# Altium schematic sheet FEEL_2021_sensors.SchDoc
size A4; SheetNumber: 4; SheetTotal: 5
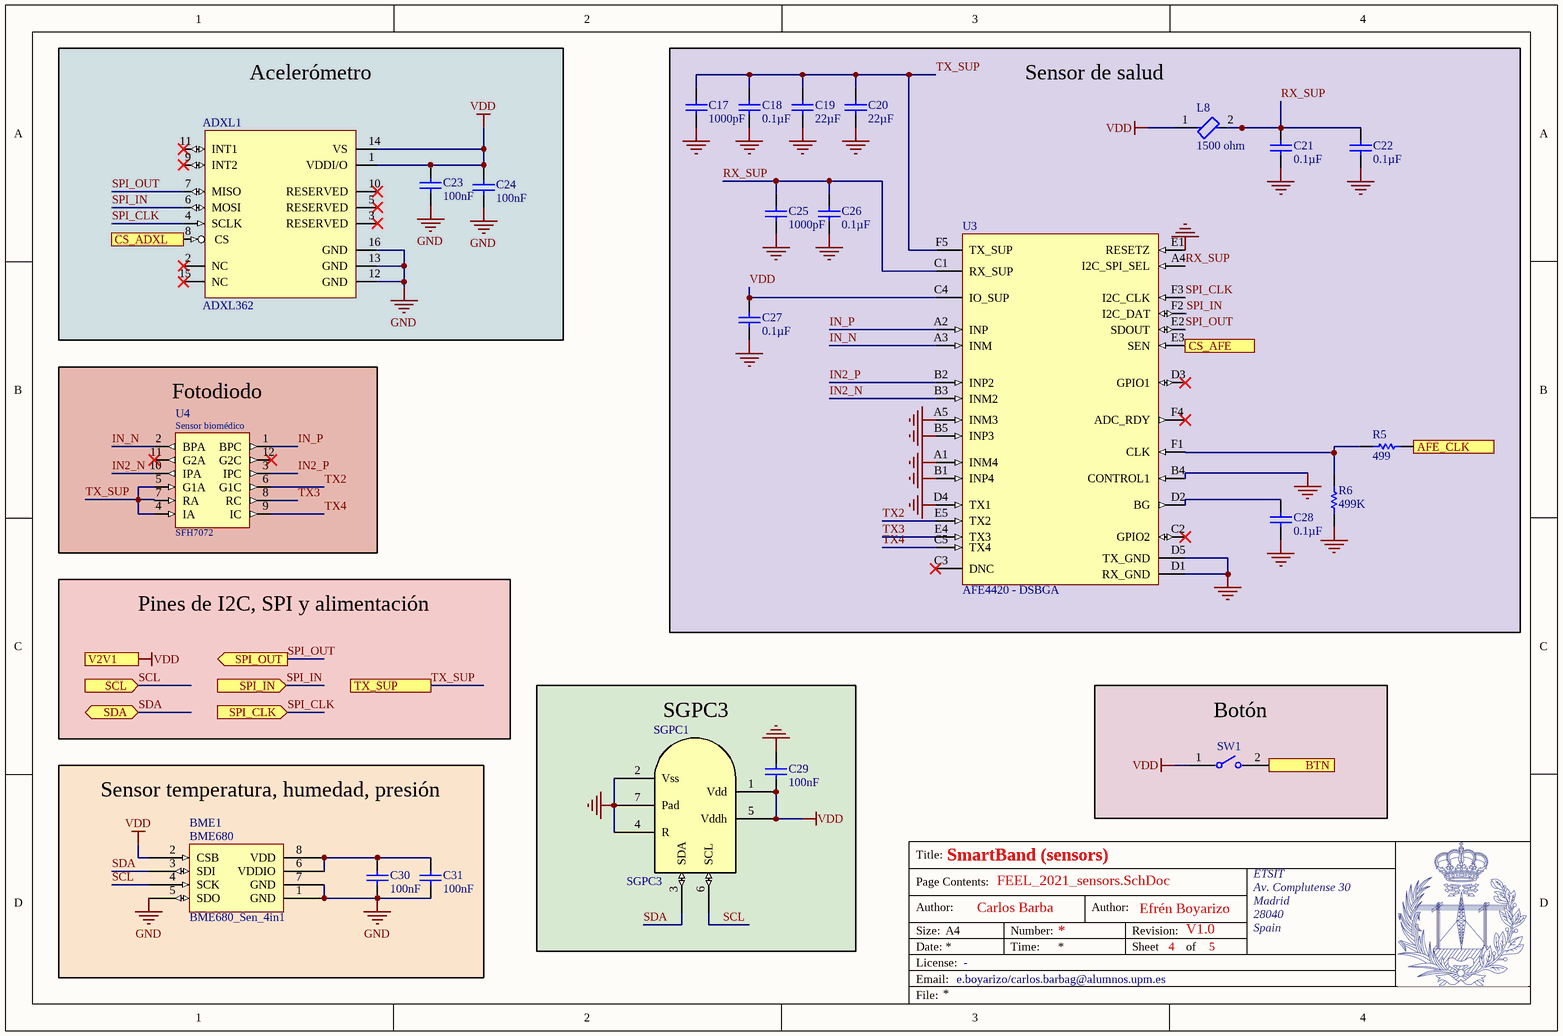
[diagram p0: FEEL_2021_sensors.SchDoc]

## Parts
ADXL1  (no value)  [ADXL362 - duplicate]
BME1  BME680_Sen_4in1  [BME_LGA8]
C17  1000pF  [CAPC1608X90X35ML10T15]
C18  0.1µF  [CAPC1608X90X35ML10T15]
C19  22µF  [CAPC1608X90X35ML10T15]
C20  22µF  [CAPC1608X90X35ML10T15]
C21  0.1µF  [CAPC1608X90X35ML10T15]
C22  0.1µF  [CAPC1608X90X35ML10T15]
C23  100nF  [CAPC1608X90X35ML10T15]
C24  100nF  [CAPC1608X90X35ML10T15]
C25  1000pF  [CAPC1608X90X35ML10T15]
C26  0.1µF  [CAPC1608X90X35ML10T15]
C27  0.1µF  [CAPC1608X90X35ML10T15]
C28  0.1µF  [CAPC1608X90X35ML10T15]
C29  100nF  [CAPC1608X90X35ML10T15]
C30  100nF  [CAPC1608X90X35ML10T15]
C31  100nF  [CAPC1608X90X35ML10T15]
L8  1500 ohm  [FP-BLM18-0_15-t0_8-MFG]
R5  499  [RESC1609X50X30NL8T20]
R6  499K  [RESC1609X50X30NL8T20]
SGPC1  SGPC3  [DFN 6-pin]
SW1  (no value)  [FP-B3U-1000P-MFG]
U3  AFE4420 - DSBGA  [AFE4420 - DSBGA]
U4  (no value)  [SFH7072]

## Ports
AFE_CLK (in), BTN (out), CS_ADXL (in), CS_AFE (in), SCL (in), SDA (bidir), SPI_CLK (in), SPI_IN (in), SPI_OUT (out), TX_SUP, V2V1

## Nets
GND: ADXL1.12(GND) ADXL1.13(GND) ADXL1.16(GND) BME1.1(GND) BME1.5(SDO) BME1.7(GND) C17.1 C18.1 C19.1 C20.1 C21.1 C22.1 C23.1 C24.1 C25.1 C26.1 C27.1 C28.1 C29.2 C30.1 C31.1 R6.1 SGPC1.2(Vss) SGPC1.4(R) SGPC1.7(Pad) U3.A1(INM4) U3.A5(INM3) U3.B1(INP4) U3.B4(CONTROL1) U3.B5(INP3) U3.D1(RX_GND) U3.D4(TX1) U3.D5(TX_GND) U3.E1(RESETZ)
VDD: ADXL1.1(VDDI/O) ADXL1.14(VS) BME1.2(CSB) C23.2 C24.2 C27.2 C29.1 L8.1 SGPC1.1(Vdd) SGPC1.5(Vddh) SW1.1 U3.C4(IO_SUP) ; port V2V1
AFE_CLK: R5.1 ; port AFE_CLK
BTN: SW1.2 ; port BTN
CS_ADXL: ADXL1.8(CS) ; port CS_ADXL
CS_AFE: U3.E3(SEN) ; port CS_AFE
IN2_N: U3.B3(INM2) U4.10(IPA)
IN2_P: U3.B2(INP2) U4.3(IPC)
IN_N: U3.A3(INM) U4.2(BPA)
IN_P: U3.A2(INP) U4.1(BPC)
RX_SUP: C21.2 C22.2 C25.2 C26.2 L8.2 U3.A4(I2C_SPI_SEL) U3.C1(RX_SUP)
SCL: BME1.4(SCK) SGPC1.6(SCL) ; port SCL
SDA: BME1.3(SDI) SGPC1.3(SDA) ; port SDA
SPI_CLK: ADXL1.4(SCLK) U3.F3(I2C_CLK) ; port SPI_CLK
SPI_IN: ADXL1.6(MOSI) U3.F2(I2C_DAT) ; port SPI_IN
SPI_OUT: ADXL1.7(MISO) U3.E2(SDOUT) ; port SPI_OUT
TX2: U3.E5(TX2) U4.6(G1C)
TX3: U3.E4(TX3) U4.8(RC)
TX4: U3.C5(TX4) U4.9(IC)
TX_SUP: C17.2 C18.2 C19.2 C20.2 U3.F5(TX_SUP) U4.4(IA) U4.5(G1A) U4.7(RA) ; port TX_SUP
NetBME1_6: BME1.6(VDDIO) BME1.8(VDD) C30.2 C31.2
NetC28_2: C28.2 U3.D2(BG)
NetR5_2: R5.2 R6.2 U3.F1(CLK)

Not connected (* = marked no-connect by the designer): ADXL1 2(NC)* 3(RESERVED)* 5(RESERVED)* 9(INT2)* 10(RESERVED)* 11(INT1)* 15(NC)*; U3 C2(GPIO2)* C3(DNC)* D3(GPIO1)* F4(ADC_RDY)*; U4 11(G2A)* 12(G2C)*

## Notes on the sheet
- Acelerómetro
- (near U4) Fotodiodo
- Sensor de salud
- Pines de I2C, SPI y alimentación
- Title:
- SmartBand (sensors)
- (near SW1) Botón
- Author:
- Page Contents:
- Carlos Barba
- Efrén Boyarizo
- V1.0
- ETSIT
- Av. Complutense 30
- Madrid
- 28040
- Sensor temperatura, humedad, presión
- SGPC3
- Size:
- Date:
- File:
- License:
- Email:
- A4
- e.boyarizo/carlos.barbag@alumnos.upm.es
- -
- Number:
- Time:
- Revision:
- Sheet
- of
- 5
- Spain
- (in symbol BME680_Sen_4in1) BME680
- (in symbol SFH7072) Sensor biomédico

## Library data of the parts
ADXL1 = ADXL362
C17-C31 = CMP-2000-04945-1: Chip Capacitor, 22 pF, +/- 5%, 50 V, -55 to 125 degC, 0603 (1608 Metric), RoHS, Tape and Reel; Manufacturer: Murata; Capacitance: 22pF; Rated Voltage: 50V; Dielectric: C0G; Manufacturer URL: http://www.murata.com/; Datasheet Version: Jul-06; Package Reference: 603; Tolerance (%): ±5%; Case Size/Dimension: 0603; Package Description: 2-Pin Surface Mount Device, Body 1.6 x 0.8 mm; Datasheet URL: https://datasheet.ciiva.com/11786/0900766b807a1cab-11786398.pdf
L8 = CMP-0686-00354-3: Chip Ferrite Bead, 0603, 600Ω @ 100MHz, 0.35Ω, 25%, 500mA; Manufacturer Series: BLM18E; Number of Lines: 1; DC Resistance (DCR): 350mR; Impedance: 600R; Material: Steel; Shielding: Unshielded; Package Quantity: 1; Case/Package: 0603; Length: 1.6mm; Packaging: Tape and Reel; Resistance: 350mR; REACH SVHC: No SVHC; Military Standard: Not; Contact Plating: Tin; Termination: SMD/SMT; Number of Circuits: 1; Width: 0.8mm; Test Frequency: 100MHz; DC Current: 500mA; Case Code (Metric): 1608; Max DC Current: 500mA; Max Operating Temperature: 125°C; Current Rating: 500mA; Series: BLM18E; Tolerance: 25%; Min Operating Temperature: -55°C; Frequency: 100MHz; Lead Free: Lead Free; Terminal Finish: Tin; Number of Pins: 2; Max Current Rating: 500mA; Radiation Hardening: No; Case Code (Imperial): 0603; Number of Functions: 1; Depth: 0.8mm; DC Resistance-Max: 350mR; Height: 0.8mm; Core Material: Ferrite; RoHS Compliant: Yes
R5 R6 = CMP-2000-03816-5: Chip Resistor, 0 Ohm, Jumper, 100 mW, -55 to 155 degC, 0603 (1608 Metric), RoHS, Tape and Reel; Manufacturer: Vishay Semiconductor; Voltage Rating: 75 V; Package Quantity: 5000; DatasheetVersion: 06/2012; Min Operating Temperature: -55 degC; ComponentLink1URL: http://www.vishay.com/; Mounting Technology: Surface Mount; Height: 0.45 mm; ComponentLink1Description: Manufacturer URL; REACH SVHC: Unknown; PackageReference: 0603; Packaging: Tape and Reel; Max Operating Temperature: 155 degC; Mount: Surface Mount; ComponentLink2Description: Datasheet; PackageDescription: 2-Pin Surface Mount Device, Body 1.575 x 0.85 mm; Length: 1.55 mm; ComponentLink2URL: http://www.vishay.com/docs/20035/dcrcwe3.pdf; Pins: 2; RoHSCompliant: true
SGPC1 = SGPC3: Indoor Air Quality Sensor for TVOC Measurements
SW1 = CMP-2100-03586-2: SWITCH TACTILE SPST-NO 0.05A 12V; Contact Resistance: 100mR; Operating Force: 1.5N; Max Current Rating: 50mA; Switch Travel: 0.15mm; Actuator Type: Standard; Mechanical Life: 200000Cycles; Ratings: Dust Proof; Illumination Type: Non-Illuminated; Throw Configuration: SPST; Actuator Length: 0.4mm; Switch Function: Off-Mom; Height: 1.2mm; Width: 3mm; Weight: 0.000776oz; Contact Material: Silver; Max Voltage Rating (DC): 12V; Insulation Resistance: 100MR; Lead Free: Lead Free; Current Rating: 50mA; Termination: SMD/SMT; Length: 4mm; Voltage Rating (DC): 12V; Contact Current Rating: 50mA; Orientation: Straight; Depth: 2.5mm; Max Operating Temperature: 70°C; Packaging: Tape and Reel; Min Operating Temperature: -25°C; Package Quantity: 1; Mount: Surface Mount; Electrical Life: 200000Cycles
U4 = SFH7072: Sensor biométrico